# EAGLE board headstage (EAGLE 6.6.0), part 1 of 2
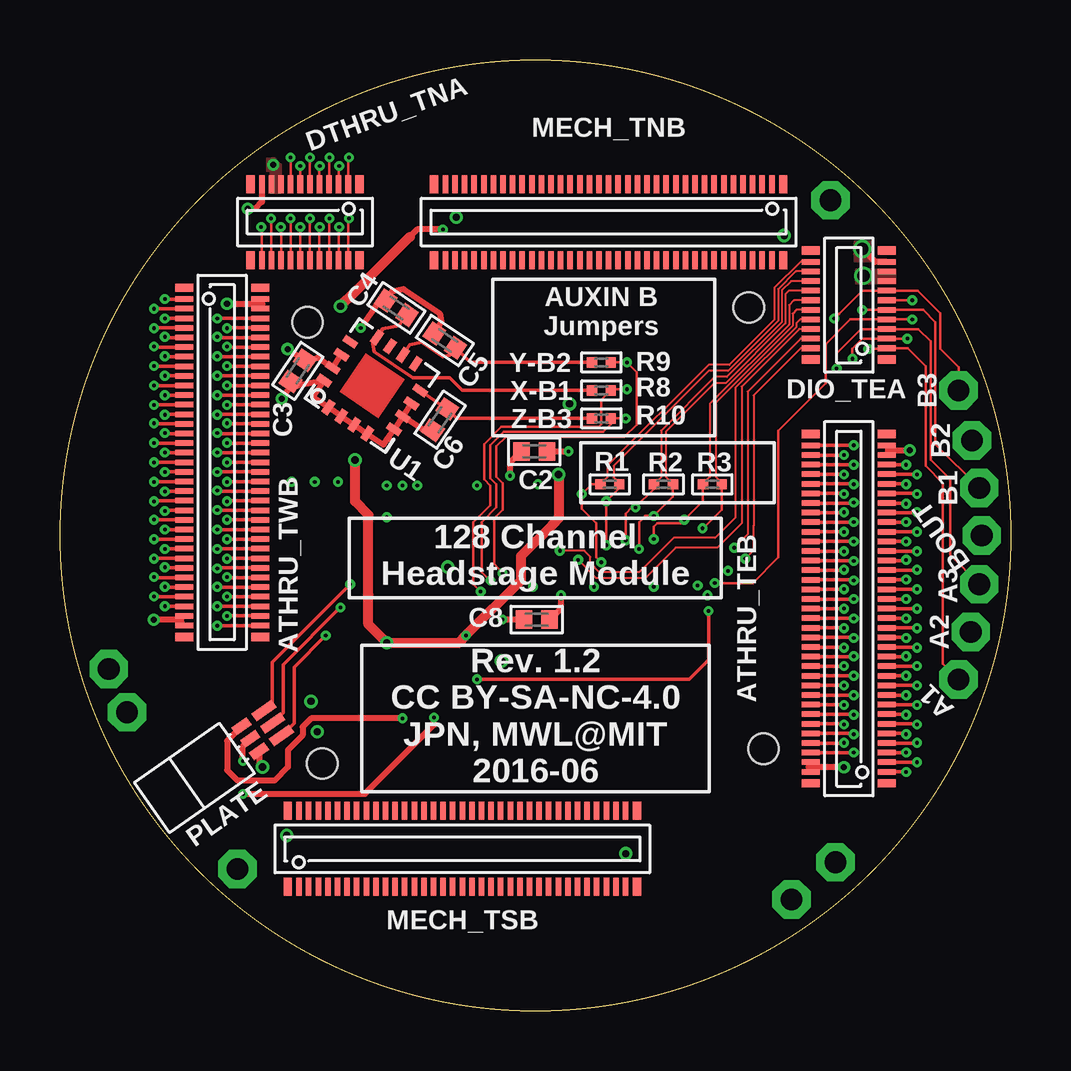
[diagram p5: board, top side]
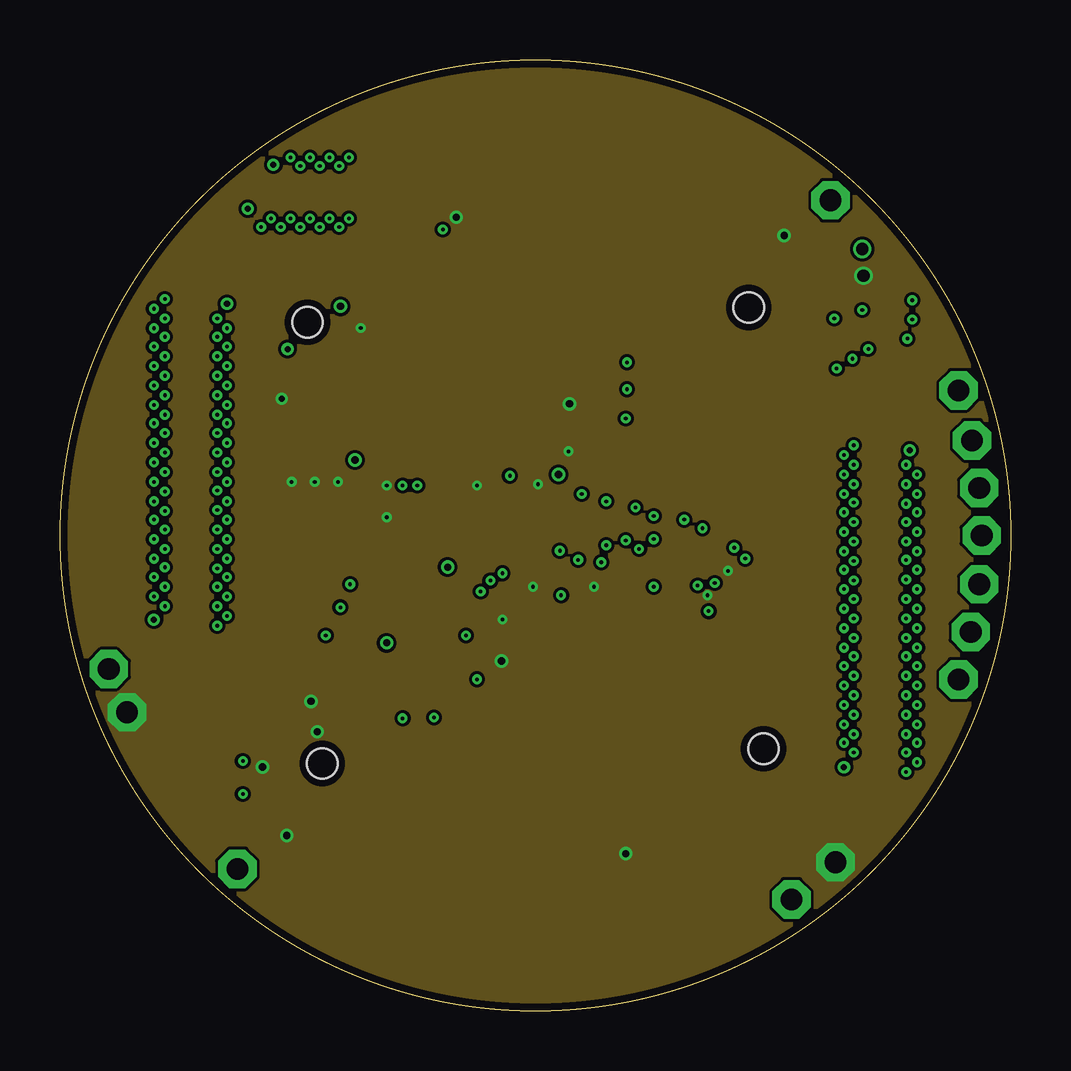
[diagram p6: board, inner layer Route2]
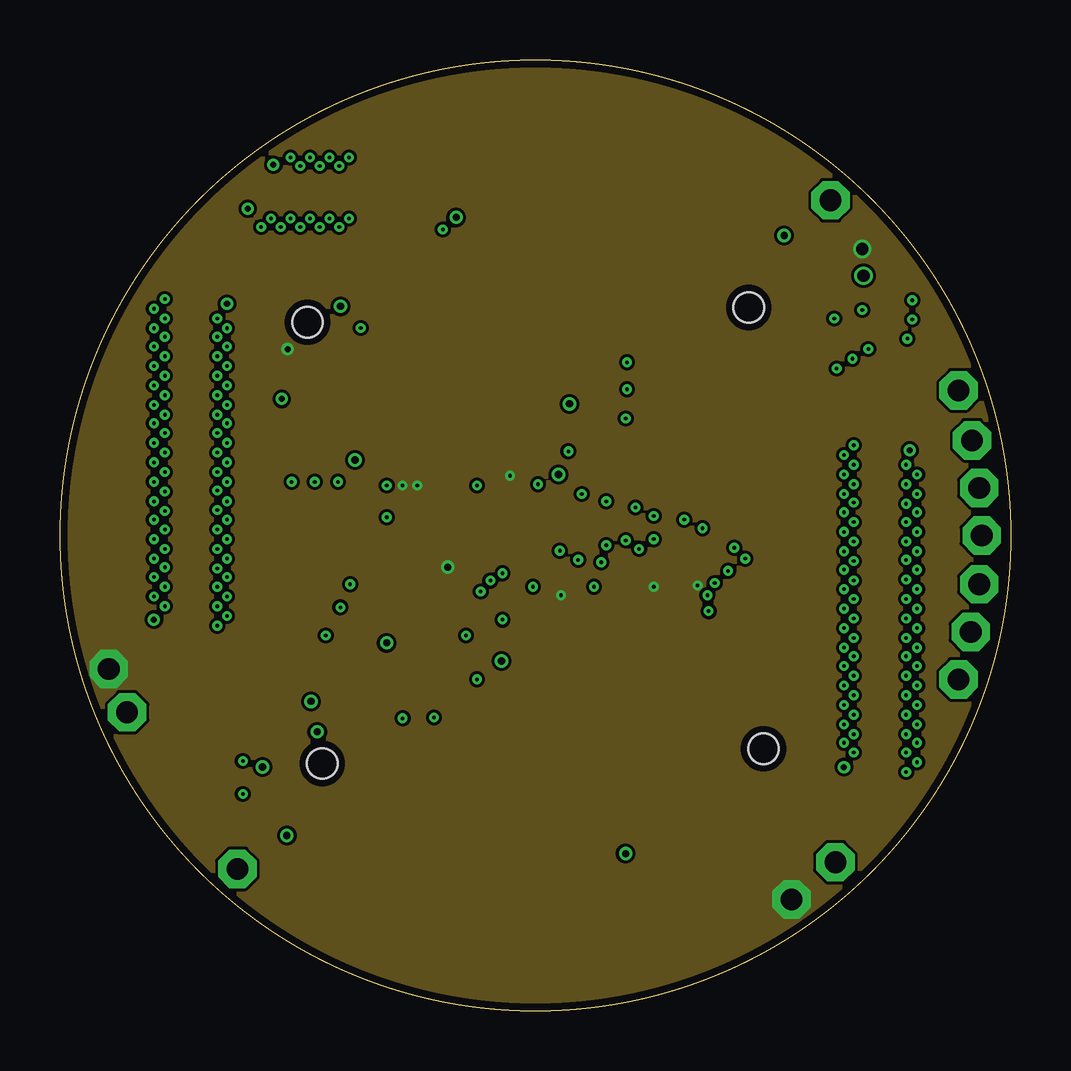
[diagram p7: board, inner layer Route3]
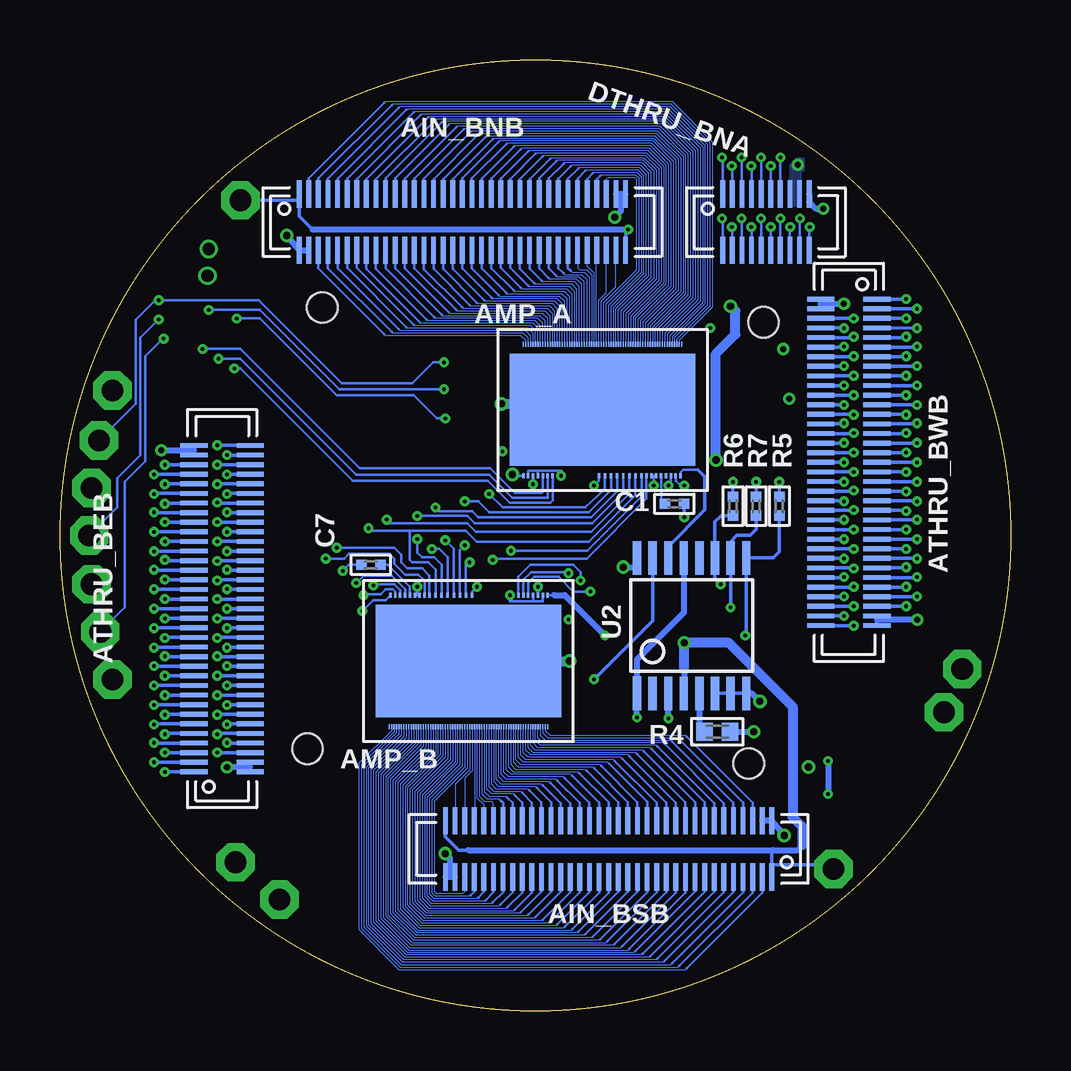
[diagram p8: board, bottom side, seen from below]

Size 39.62 x 39.62 mm. Coordinates in mm from the lower left corner, seen from the top.
Outline: circle at 19.81,19.81 radius 19.81
Copper layers (1*2+3*16): Top 0.035mm / dielectric 1.5mm / Route2 0.035mm / dielectric 0.15mm / Route3 0.035mm / dielectric 0.2mm / Bottom 0.035mm
Design rules "Precision-Image *": minimum track width 2mil, minimum drill 6mil, track to track 0.050290625mm, track to pad 0.050290625mm, pad to pad 0.050290625mm, via to via 0.050290625mm, smd to smd 0.050290625mm, copper to edge 12mil, drill to drill 15mil, minimum pad ring 5mil, minimum via ring 5mil, stop-mask expansion 2mil, vias tented up to drill 20mil, thermal gap 10mil
Net classes: 1 thick: width 0.102 mm
Holes 1.27 mm at 10.31,28.7 28.7,29.31 29.31,10.92 10.92,10.31

## Footprints (pad centres in the part's own frame; a part is rotated, then mirrored left to right if it is on the bottom)
TESTPOINT_SMALL = drill 0.9 pad 1.6 octagon: 1 0,0
DF40-70REC = smd 0.2 x 1.14: 1 -6.8,1.17; 2 -6.4,1.17; 3 -6,1.17; 4 -5.6,1.17; 5 -5.2,1.17; 6 -4.8,1.17; 7 -4.4,1.17; 8 -4,1.17; 9 -3.6,1.17; 10 -3.2,1.17; 11 -2.8,1.17; 12 -2.4,1.17; 13 -2,1.17; 14 -1.6,1.17; 15 -1.2,1.17; 16 -0.8,1.17; 17 -0.4,1.17; 18 0,1.17; 19 0.4,1.17; 20 0.8,1.17; 21 1.2,1.17; 22 1.6,1.17; 23 2,1.17; 24 2.4,1.17; 25 2.8,1.17; 26 3.2,1.17; 27 3.6,1.17; 28 4,1.17; 29 4.4,1.17; 30 4.8,1.17; 31 5.2,1.17; 32 5.6,1.17; 33 6,1.17; 34 6.4,1.17; 35 6.8,1.17; 36 6.8,-1.17; 37 6.4,-1.17; 38 6,-1.17; 39 5.6,-1.17; 40 5.2,-1.17; 41 4.8,-1.17; 42 4.4,-1.17; 43 4,-1.17; 44 3.6,-1.17; 45 3.2,-1.17; 46 2.8,-1.17; 47 2.4,-1.17; 48 2,-1.17; 49 1.6,-1.17; 50 1.2,-1.17; 51 0.8,-1.17; 52 0.4,-1.17; 53 0,-1.17; 54 -0.4,-1.17; 55 -0.8,-1.17; 56 -1.2,-1.17; 57 -1.6,-1.17; 58 -2,-1.17; 59 -2.4,-1.17; 60 -2.8,-1.17; 61 -3.2,-1.17; 62 -3.6,-1.17; 63 -4,-1.17; 64 -4.4,-1.17; 65 -4.8,-1.17; 66 -5.2,-1.17; 67 -5.6,-1.17; 68 -6,-1.17; 69 -6.4,-1.17; 70 -6.8,-1.17
RHD2164_COB = smd 0.051 x 0.203: 0 -3.2,2.743; 1 -3.099,2.743; 2 -2.997,2.743; 3 -2.896,2.743; 4 -2.794,2.743; 5 -2.692,2.743; 6 -2.591,2.743; 7 -2.489,2.743; 8 -2.388,2.743; 9 -2.286,2.743; 10 -2.184,2.743; 11 -2.083,2.743; 12 -1.981,2.743; 13 -1.88,2.743; 14 -1.778,2.743; 15 -1.676,2.743; 16 -1.575,2.743; 17 -1.473,2.743; 18 -1.372,2.743; 19 -1.27,2.743; 20 -1.168,2.743; 21 -1.067,2.743; 22 -0.965,2.743; 23 -0.864,2.743; 24 -0.762,2.743; 25 -0.66,2.743; 26 -0.559,2.743; 27 -0.457,2.743; 28 -0.356,2.743; 29 -0.254,2.743; 30 -0.152,2.743; 31 -0.051,2.743; 32 0.051,2.743; 33 0.152,2.743; 34 0.254,2.743; 35 0.356,2.743; 36 0.457,2.743; 37 0.559,2.743; 38 0.66,2.743; 39 0.762,2.743; 40 0.864,2.743; 41 0.965,2.743; 42 1.067,2.743; 43 1.168,2.743; 44 1.27,2.743; 45 1.372,2.743; 46 1.473,2.743; 47 1.575,2.743; 48 1.676,2.743; 49 1.778,2.743; 50 1.88,2.743; 51 1.981,2.743; 52 2.083,2.743; 53 2.184,2.743; 54 2.286,2.743; 55 2.388,2.743; 56 2.489,2.743; 57 2.591,2.743; 58 2.692,2.743; 59 2.794,2.743; 60 2.896,2.743; 61 2.997,2.743; 62 3.099,2.743; 63 3.2,2.743; A -3.302,2.743; B 3.302,2.743 | smd 0.102 x 0.203: B1 -3.302,-2.743; B2 -3.099,-2.743; B3 -2.896,-2.743; B4 -2.692,-2.743; B5 -2.489,-2.743; B6 -2.286,-2.743; B7 -2.083,-2.743; B8 -0.152,-2.743; B9 0.102,-2.743; B10 0.356,-2.743; B11 0.61,-2.743; B12 0.864,-2.743; B13 1.118,-2.743; B14 1.372,-2.743; B15 1.626,-2.743; B16 1.829,-2.743; B17 2.032,-2.743; B18 2.235,-2.743; B19 2.438,-2.743; B20 2.642,-2.743; B21 2.845,-2.743; B22 3.048,-2.743; B23 3.251,-2.743 | smd 7.722 x 4.674: CENTER 0,0
DF40-70HEAD = smd 0.23 x 0.75: 1 -6.8,-1.585; 2 -6.4,-1.585; 3 -6,-1.585; 4 -5.6,-1.585; 5 -5.2,-1.585; 6 -4.8,-1.585; 7 -4.4,-1.585; 8 -4,-1.585; 9 -3.6,-1.585; 10 -3.2,-1.585; 11 -2.8,-1.585; 12 -2.4,-1.585; 13 -2,-1.585; 14 -1.6,-1.585; 15 -1.2,-1.585; 16 -0.8,-1.585; 17 -0.4,-1.585; 18 0,-1.585; 19 0.4,-1.585; 20 0.8,-1.585; 21 1.2,-1.585; 22 1.6,-1.585; 23 2,-1.585; 24 2.4,-1.585; 25 2.8,-1.585; 26 3.2,-1.585; 27 3.6,-1.585; 28 4,-1.585; 29 4.4,-1.585; 30 4.8,-1.585; 31 5.2,-1.585; 32 5.6,-1.585; 33 6,-1.585; 34 6.4,-1.585; 35 6.8,-1.585; 36 6.8,1.585; 37 6.4,1.585; 38 6,1.585; 39 5.6,1.585; 40 5.2,1.585; 41 4.8,1.585; 42 4.4,1.585; 43 4,1.585; 44 3.6,1.585; 45 3.2,1.585; 46 2.8,1.585; 47 2.4,1.585; 48 2,1.585; 49 1.6,1.585; 50 1.2,1.585; 51 0.8,1.585; 52 0.4,1.585; 53 0,1.585; 54 -0.4,1.585; 55 -0.8,1.585; 56 -1.2,1.585; 57 -1.6,1.585; 58 -2,1.585; 59 -2.4,1.585; 60 -2.8,1.585; 61 -3.2,1.585; 62 -3.6,1.585; 63 -4,1.585; 64 -4.4,1.585; 65 -4.8,1.585; 66 -5.2,1.585; 67 -5.6,1.585; 68 -6,1.585; 69 -6.4,1.585; 70 -6.8,1.585 | smd 0.35 x 0.75: M1 -7.275,-1.585; M2 7.275,-1.585; M3 7.275,1.585; M4 -7.275,1.585
0201 = smd 0.432 x 0.432: 1 -0.394,0; 2 0.394,0
0402 = smd 0.686 x 0.762: 1 -0.533,0; 2 0.533,0
DF40-20HEAD = smd 0.23 x 0.75: 1 -1.8,-1.585; 2 -1.4,-1.585; 3 -1,-1.585; 4 -0.6,-1.585; 5 -0.2,-1.585; 6 0.2,-1.585; 7 0.6,-1.585; 8 1,-1.585; 9 1.4,-1.585; 10 1.8,-1.585; 11 1.8,1.585; 12 1.4,1.585; 13 1,1.585; 14 0.6,1.585; 15 0.2,1.585; 16 -0.2,1.585; 17 -0.6,1.585; 18 -1,1.585; 19 -1.4,1.585; 20 -1.8,1.585 | smd 0.35 x 0.75: M1 -2.275,-1.585; M2 2.275,-1.585; M3 2.275,1.585; M4 -2.275,1.585
DF40-20REC = smd 0.2 x 1.14: 1 -1.8,1.17; 2 -1.4,1.17; 3 -1,1.17; 4 -0.6,1.17; 5 -0.2,1.17; 6 0.2,1.17; 7 0.6,1.17; 8 1,1.17; 9 1.4,1.17; 10 1.8,1.17; 11 1.8,-1.17; 12 1.4,-1.17; 13 1,-1.17; 14 0.6,-1.17; 15 0.2,-1.17; 16 -0.2,-1.17; 17 -0.6,-1.17; 18 -1,-1.17; 19 -1.4,-1.17; 20 -1.8,-1.17
OMNETICS_PZN-06-AA = smd 0.381 x 0.762: B1 0.635,-1.016; B2 0,-1.016; B3 -0.635,-1.016 | smd 0.381 x 1.016: T1 0.635,-2.159; T2 0,-2.159; T3 -0.635,-2.159
ADXL335 = smd 0.61 x 0.305: COM1 -1.775,-0.3; NC1 -1.775,1; NC2 -1.775,-0.95; NC3 1.775,-1; NC4 1.775,0.3; ST -1.775,0.35; XOUT 1.775,0.95; YOUT 1.775,-0.35 | smd 0.305 x 0.61: COM2 -1,-1.775; COM3 -0.35,-1.775; COM4 0.3,-1.775; NC5 1,1.775; NC6 -0.95,1.775; VS1 0.35,1.775; VS2 -0.3,1.775; ZOUT 0.95,-1.775
TSSOP-16 = smd 0.348 x 1.397: 1 -2.273,-2.814; 2 -1.623,-2.815; 3 -0.973,-2.815; 4 -0.323,-2.815; 5 0.327,-2.815; 6 0.977,-2.815; 7 1.627,-2.815; 8 2.277,-2.815; 9 2.277,2.825; 10 1.627,2.825; 11 0.977,2.825; 12 0.327,2.825; 13 -0.323,2.825; 14 -0.973,2.825; 15 -1.623,2.825; 16 -2.273,2.825

## Placement (x,y rotation side)
A1  [TESTPOINT_SMALL]  37.44,13.82 0 top
A2  [TESTPOINT_SMALL]  37.95,15.8 0 top
A3  [TESTPOINT_SMALL]  38.3,17.78 0 top
AIN_BNB  DF40REC  [DF40-70REC]  22.86,32.87 0 bottom
AIN_BSB  DF40REC  [DF40-70REC]  16.76,6.76 180 bottom
AMP_A  RHD2164  [RHD2164_COB]  17.02,25.04 0 bottom
AMP_B  RHD2164  [RHD2164_COB]  22.61,14.58 180 bottom
ATHRU_BEB  DF40REC  [DF40-70REC]  32.87,16.76 90 bottom
ATHRU_BWB  DF40REC  [DF40-70REC]  6.76,22.86 270 bottom
ATHRU_TEB  DF40HEAD  [DF40-70HEAD]  32.87,16.76 90 top
ATHRU_TWB  DF40HEAD  [DF40-70HEAD]  6.76,22.86 270 top
B1  [TESTPOINT_SMALL]  38.3,21.79 0 top
B2  [TESTPOINT_SMALL]  38,23.77 0 top
B3  [TESTPOINT_SMALL]  37.44,25.86 0 top
BOUT  [TESTPOINT_SMALL]  38.4,19.81 0 top
C1  10n  [0201]  14.02,21.13 0 bottom
C2  .1uF  [0402]  19.76,23.32 0 top
C3  .1uF  [0402]  9.91,26.67 236 top
C4  .1uF  [0402]  14.02,29.3 326 top
C5  .1uF  [0402]  16.04,27.93 326 top
C6  .1uF  [0402]  15.84,24.64 56 top
C7  10n  [0201]  26.67,18.59 180 bottom
C8  .1uF  [0402]  19.86,16.31 180 top
DIO_TEA  DF40HEAD  [DF40-20HEAD]  32.87,29.41 90 top
DTHRU_BNA  DF40REC  [DF40-20REC]  10.21,32.87 0 bottom
DTHRU_TNA  DF40HEAD  [DF40-20HEAD]  10.21,32.87 180 top
GND  GND  [TESTPOINT_SMALL]  32.31,6.2 0 top
GND.  GND  [TESTPOINT_SMALL]  2.79,12.45 0 top
MECH_TNB  DF40HEAD  [DF40-70HEAD]  22.86,32.87 180 top
MECH_TSB  DF40HEAD  [DF40-70HEAD]  16.76,6.76 0 top
PLATE  PZN-06  [OMNETICS_PZN-06-AA]  7.1,10.75 125 top
R1  100  [0201]  22.91,21.95 0 top
R2  100  [0201]  25.15,21.95 0 top
R3  100  [0201]  27.18,21.95 0 top
R4  0  [0402]  12.24,11.63 180 bottom
R5  100k  [0201]  9.65,21.03 270 bottom
R6  100k  [0201]  10.62,21.03 270 bottom
R7  100k  [0201]  11.58,21.03 270 bottom
R8  0  [0201]  22.56,25.86 180 top
R9  0  [0201]  22.56,27.03 180 top
R10  0  [0201]  22.56,24.69 180 top
REF1  REF  [TESTPOINT_SMALL]  7.39,5.92 0 top
REF2  REF  [TESTPOINT_SMALL]  32.11,33.78 0 top
U1  ADXL335  [ADXL335]  13,26.06 56 top
U2  74HC4053  [TSSOP-16]  13.31,16.05 0 bottom
VCC1  VCC  [TESTPOINT_SMALL]  30.48,4.65 0 top
VCC2  VCC  [TESTPOINT_SMALL]  2.03,14.25 0 top